# Altium schematic sheet Relay Old.SchDoc
size A
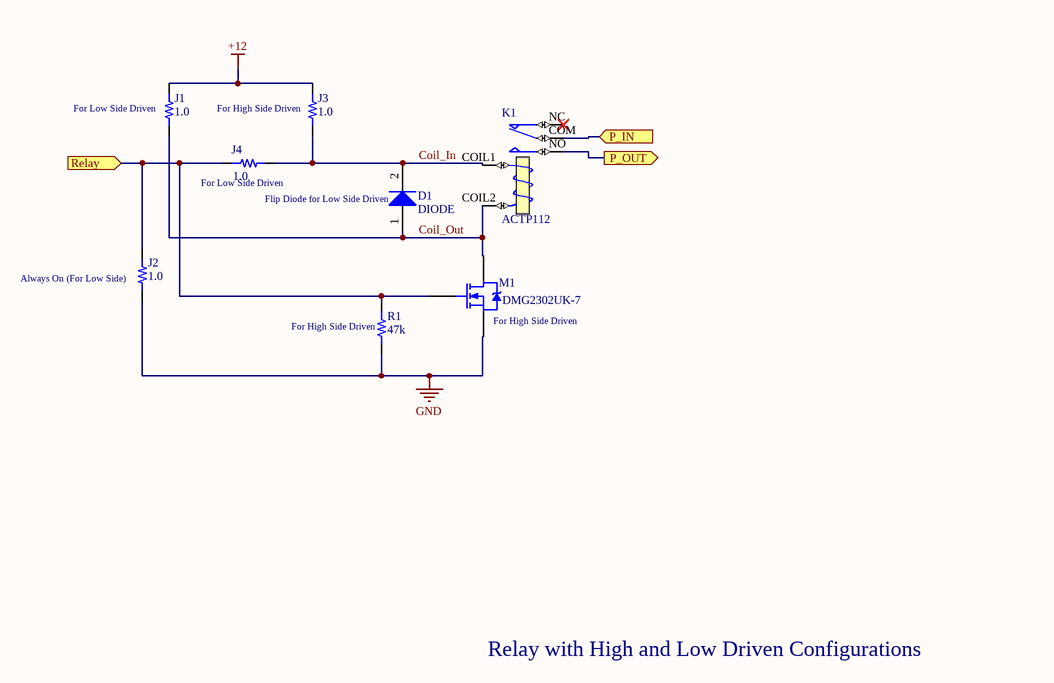
[diagram p0: Relay Old.SchDoc]

## Parts
D1  DIODE  [SOD123F]
J1  value 1.0  [RES 0805/2012]  (hidden comment: Resistor 1.0 0805 1/10W 10%)
J2  value 1.0  [RES 0805/2012]  (hidden comment: Resistor 1.0 0805 1/10W 10%)
J3  value 1.0  [RES 0805/2012]  (hidden comment: Resistor 1.0 0805 1/10W 10%)
J4  value 1.0  [RES 0805/2012]  (hidden comment: Resistor 1.0 0805 1/10W 10%)
K1  ACTP112  [ACTP112]
M1  DMG2302UK-7  [SOT23-3]
R1  value 47k  [RES 0805/2012]  (hidden comment: Resistor 47k 0805 1/10W 10%)

## Ports
P_IN (in), P_OUT (out), Relay (in)

## Nets
+12: J1.1 J3.1
GND: J2.2 M1.2(S) R1.1
Coil_In: D1.2(K) J3.2 J4.2 K1.COIL1(T1)
Coil_Out: D1.1(A) J1.2 K1.COIL2(T2) M1.3(D)
P_IN: K1.COM ; port P_IN
P_OUT: K1.NO ; port P_OUT
Relay: J2.1 J4.1 M1.1(G) R1.2 ; port Relay

Not connected (* = marked no-connect by the designer): K1 NC*

## Notes on the sheet
- (near J1) For Low Side Driven
- (near J3) For High Side Driven
- (near J4) For Low Side Driven
- (near D1) Flip Diode for Low Side Driven
- (near J2) Always On (For Low Side)
- (near R1) For High Side Driven
- (near M1) For High Side Driven
- Relay with High and Low Driven Configurations

## Library data of the parts
D1 = 2: Diode Super Barrier 40V 1A Surface Mount SOD-123F; Manufacturer_id: 1; MfrPartNo: 1N5819HW1-7-F; idDiode: 2; Name: 1N5819; Drawer_id: 1; Value: 1A; Type: Super Barrier; Num_Circuits: 1; Ic: 1A; Power: 40V; Package: SOD-123; Link: https://www.digikey.com/product-detail/en/diodes-incorporated/1N5819HW1-7-F/1N5819HW1-7-FDITR-ND/5768523; ComponentLink1Description: Datasheet; ComponentLink1URL: https://www.diodes.com/assets/Datasheets/1N5819HW1.pdf; Supplier1: Digi-Key; Supplier1PartNo: 1N5819HW1-7-FDITR-ND
J1-J4 = 2377: Manufacturer_id: 1; idResistor: 2377; Name: Res_1.0_0805_1/10W_10%; Created_By: Nick Mah; Supplier 1: Digi-Key; Drawer_id: 1; Tolerance: 10%; Power: 1/10W; Package: 0805; ComponentLink1Description: Datasheet; Created_Date: 2018-10-20
K1 = 3: Manufacturer_id: 1; idRelay: 3; Coil_Voltage: 12V; Published: 8-Jun-2000; LatestRevisionDate: 17-Jul-2002; LatestRevisionNote: Re-released for DXP Platform.; PackageReference: MODULE5B; Publisher: Altium Limited; Drawer_id: 1; Name: ACTP112
M1 = 6: MOSFET N-CHANNEL 30V 5A SOT23; Manufacturer_id: 1; idFETs: 6; Value: N_Channel; Vdss: 20V; Id: 2.8A; Rds_On: 90mOhm; Vgs(typ): 800mV; Vgs(Max): 1V; Created_By: Angel; MfrPartNo: DMG2302UK-7; Drawer_id: 1; Name: DMG2302UK-7; Num_Circuits: 1; Package: SOT-23; Link: https://www.digikey.com/product-detail/en/diodes-incorporated/DMG2302UK-7/DMG2302UK-7DICT-ND/6010163; Supplier1: Digi-Key
R1 = 2433: Manufacturer_id: 1; idResistor: 2433; Name: Res_47k_0805_1/10W_10%; Created_By: Nick Mah; Supplier 1: Digi-Key; Drawer_id: 1; Tolerance: 10%; Power: 1/10W; Package: 0805; ComponentLink1Description: Datasheet; Created_Date: 2018-10-20